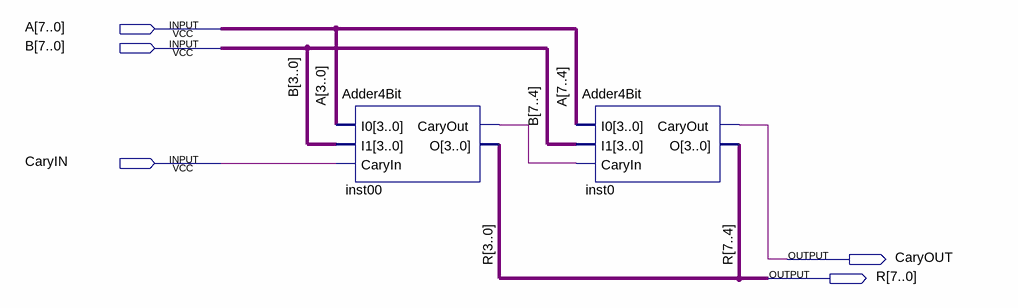
[diagram p0: schematic sheet]
// Quartus schematic Adder8Bit.bdf as structural Verilog: 2 symbols, 5 pins
module Adder8Bit (
  input  [7:0] A,
  input  [7:0] B,
  input  CaryIN,
  output CaryOUT,
  output [7:0] R
);

  wire inst00_caryout;

  Adder4Bit inst00 (.I0(A[3:0]), .I1(B[3:0]), .CaryIn(CaryIN), .CaryOut(inst00_caryout), .O(R[3:0]));
  Adder4Bit inst0 (.I0(A[7:4]), .I1(B[7:4]), .CaryIn(inst00_caryout), .CaryOut(CaryOUT), .O(R[7:4]));
endmodule
